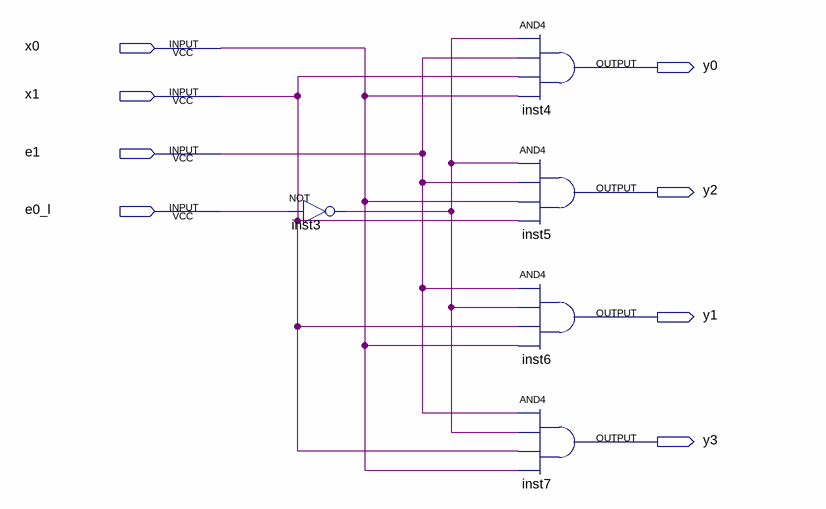
[diagram p0: schematic sheet]
// Quartus schematic Dec2_4.bdf as structural Verilog: 5 symbols, 8 pins
module Dec2_4 (
  input  x0,
  input  x1,
  input  e1,
  input  e0_l,
  output y0,
  output y2,
  output y1,
  output y3
);

  wire inst3_out;

  not inst3 (inst3_out, e0_l);
  and inst4 (y0, inst3_out, e1, x1, x0);
  and inst5 (y2, inst3_out, e1, x0, x1);
  and inst6 (y1, e1, inst3_out, x1, x0);
  and inst7 (y3, e1, inst3_out, x1, x0);
endmodule
